# EAGLE design H-Bridge-Discrete (EAGLE 7.2.0)
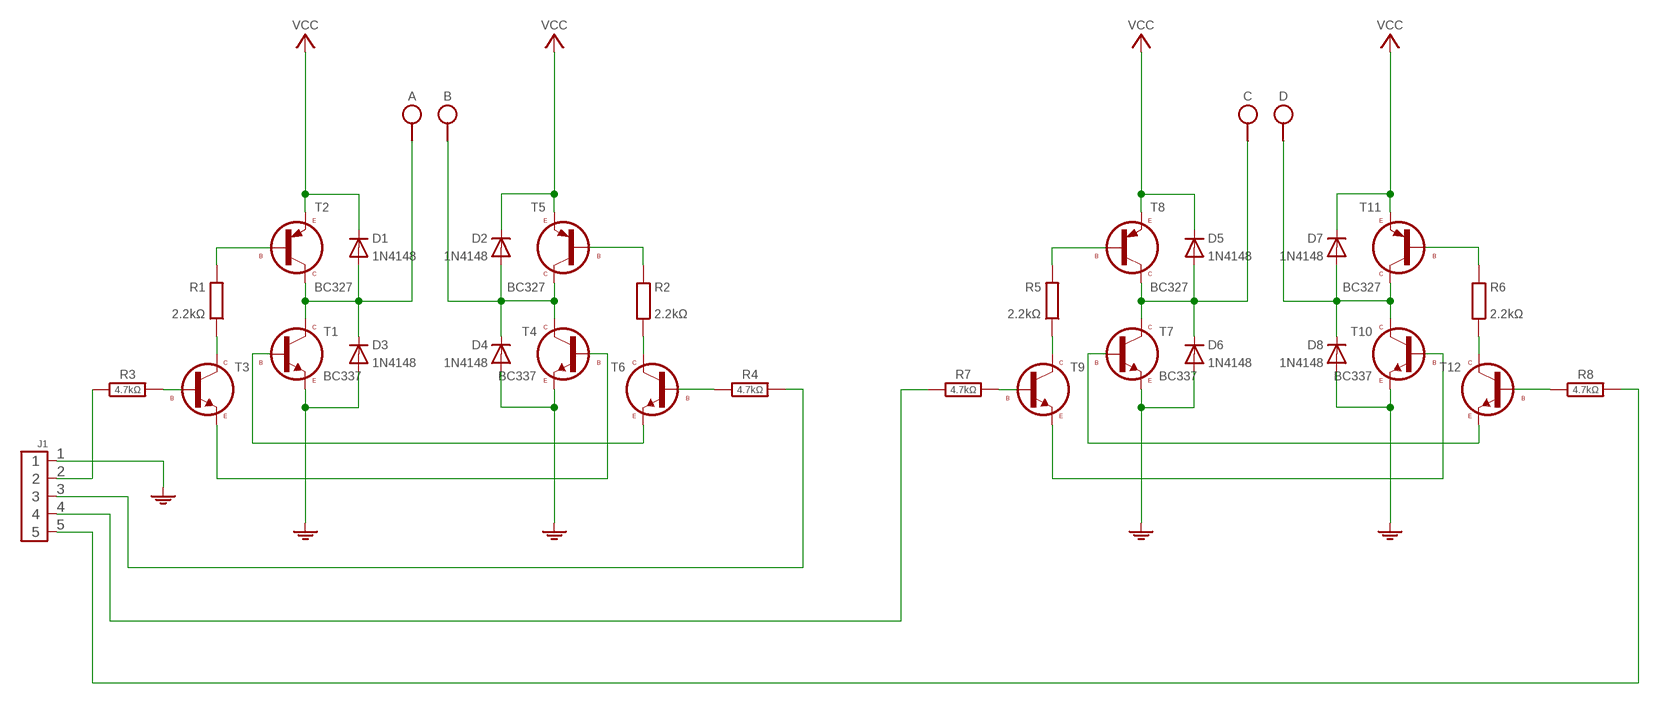
[diagram p0: schematic, sheet 1]

## Parts
A  VPORT  [SPAD]
B  VPORT  [SPAD]
C  VPORT  [SPAD]
D  VPORT  [SPAD]
D1  1N4148  DIODE-7-5  [DO7-5]
D2  1N4148  DIODE-7-5  [DO7-5]
D3  1N4148  DIODE-7-5  [DO7-5]
D4  1N4148  DIODE-7-5  [DO7-5]
D5  1N4148  DIODE-7-5  [DO7-5]
D6  1N4148  DIODE-7-5  [DO7-5]
D7  1N4148  DIODE-7-5  [DO7-5]
D8  1N4148  DIODE-7-5  [DO7-5]
J1  CONN-5P-5P  [CONN-5P]
R1  2.2kΩ  R0204/10  [0204/10]
R2  2.2kΩ  R0204/2  [0204/2]
R3  4.7kΩ  R-H0204/10  [0204/10]
R4  4.7kΩ  R-H0204/10  [0204/10]
R5  2.2kΩ  R0204/10  [0204/10]
R6  2.2kΩ  R0204/10  [0204/10]
R7  4.7kΩ  R-H0204/10  [0204/10]
R8  4.7kΩ  R-H0204/10  [0204/10]
S1  VCC_GND-508-L  [PWR-508-L]
T1  BC337  BC337CBE  [TO92-CBE]
T2  BC327  [TO92]
T3  BC547  [TO92]
T4  BC337  BC337CBE  [TO92-CBE]
T5  BC327  [TO92]
T6  BC547  [TO92]
T7  BC337  BC337CBE  [TO92-CBE]
T8  BC327  [TO92]
T9  BC547  [TO92]
T10  BC337  BC337CBE  [TO92-CBE]
T11  BC327  [TO92]
T12  BC547  [TO92]

## Nets
GND: D3.A D4.A D6.A D8.A J1.1 S1.1 T1.3(E) T4.3(E) T7.3(E) T10.3(E)
N$1: R2.1 T5.2(B)
N$2: R2.2 T6.1(C)
N$3: T1.2(B) T6.3(E)
N$4: R1.1 T2.2(B)
N$5: R1.2 T3.1(C)
N$6: T3.3(E) T4.2(B)
N$7: B.1 D2.A D4.C T4.1(C) T5.1(C)
N$8: A.1 D1.A D3.C T1.1(C) T2.1(C)
N$9: R3.2 T3.2(B)
N$10: R4.1 T6.2(B)
N$11: J1.2 R3.1
N$12: J1.3 R4.2
N$13: R5.1 T8.2(B)
N$14: R5.2 T9.1(C)
N$15: T9.3(E) T10.2(B)
N$16: C.1 D5.A D6.C T7.1(C) T8.1(C)
N$17: R6.1 T11.2(B)
N$18: R6.2 T12.1(C)
N$19: T7.2(B) T12.3(E)
N$20: D7.A D8.C D.1 T10.1(C) T11.1(C)
N$21: R8.1 T12.2(B)
N$22: R7.2 T9.2(B)
N$23: J1.5 R8.2
N$24: J1.4 R7.1
VCC: D1.C D2.C D5.C D7.C S1.2 T2.3(E) T5.3(E) T8.3(E) T11.3(E)

## Library data of the parts
A B C D = pad:VPORT
D1-D8 = d:DIODE
J1 = pinconn:CONN-5P
R1 R2 R5 R6 = r:R: RESISTOR, European symbol
R3 R4 R7 R8 = r:R-H
S1 = pad:VCC_GND
T1 T4 T7 T10 = t:BC337
T2 T5 T8 T11 = t:BC327
T3 T6 T9 T12 = t:BC547

## Board
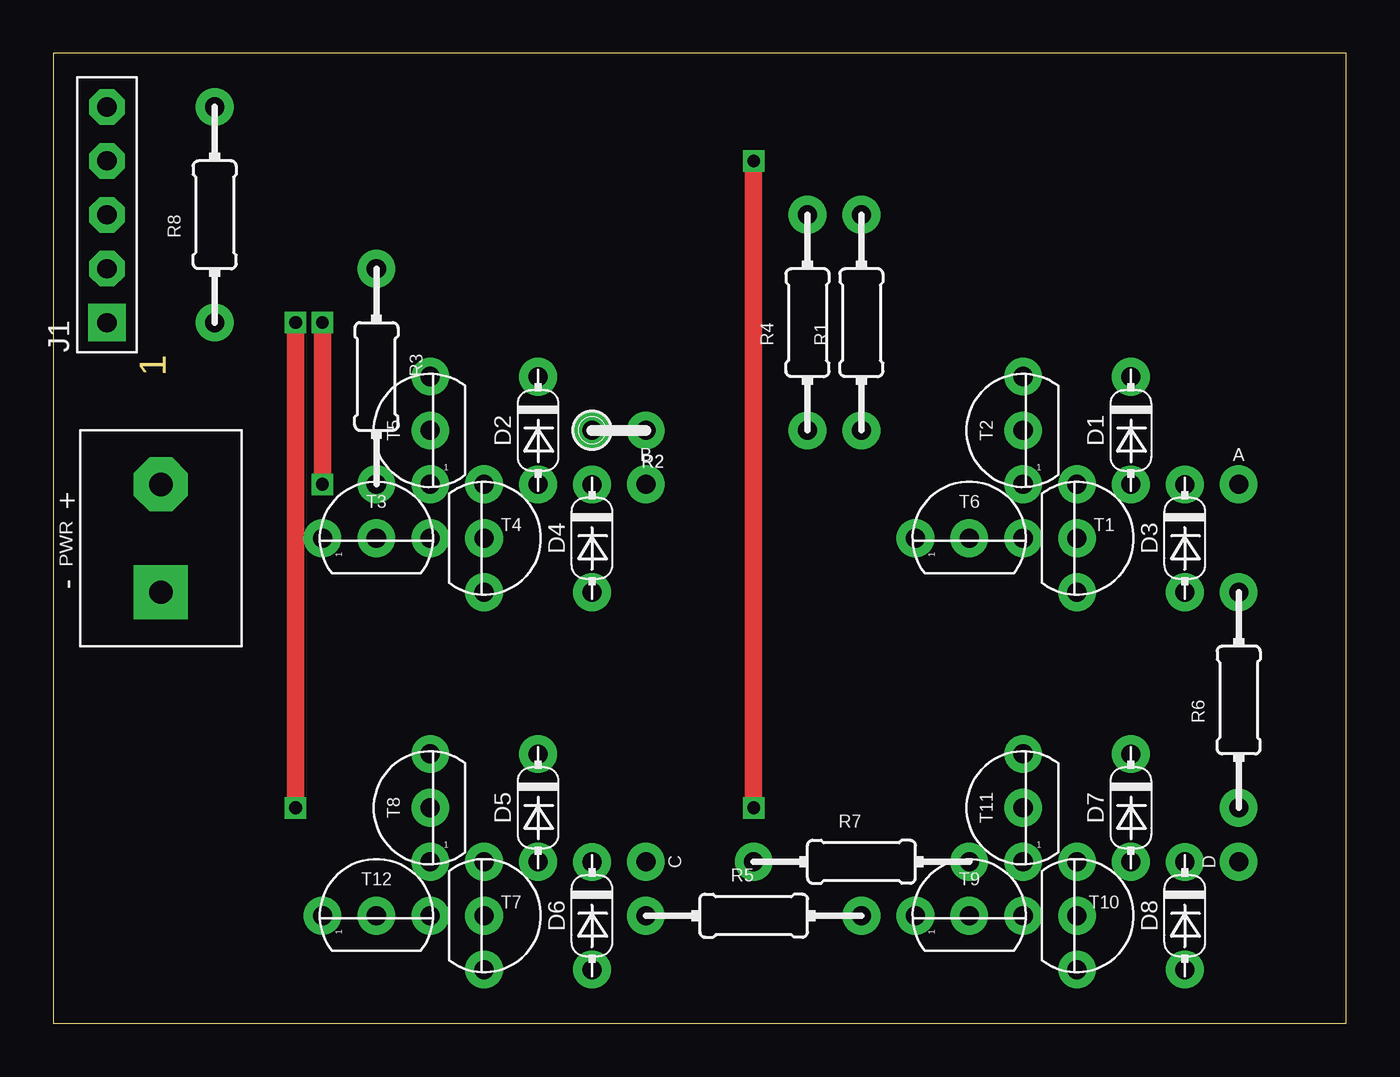
[diagram p1: board, top side]
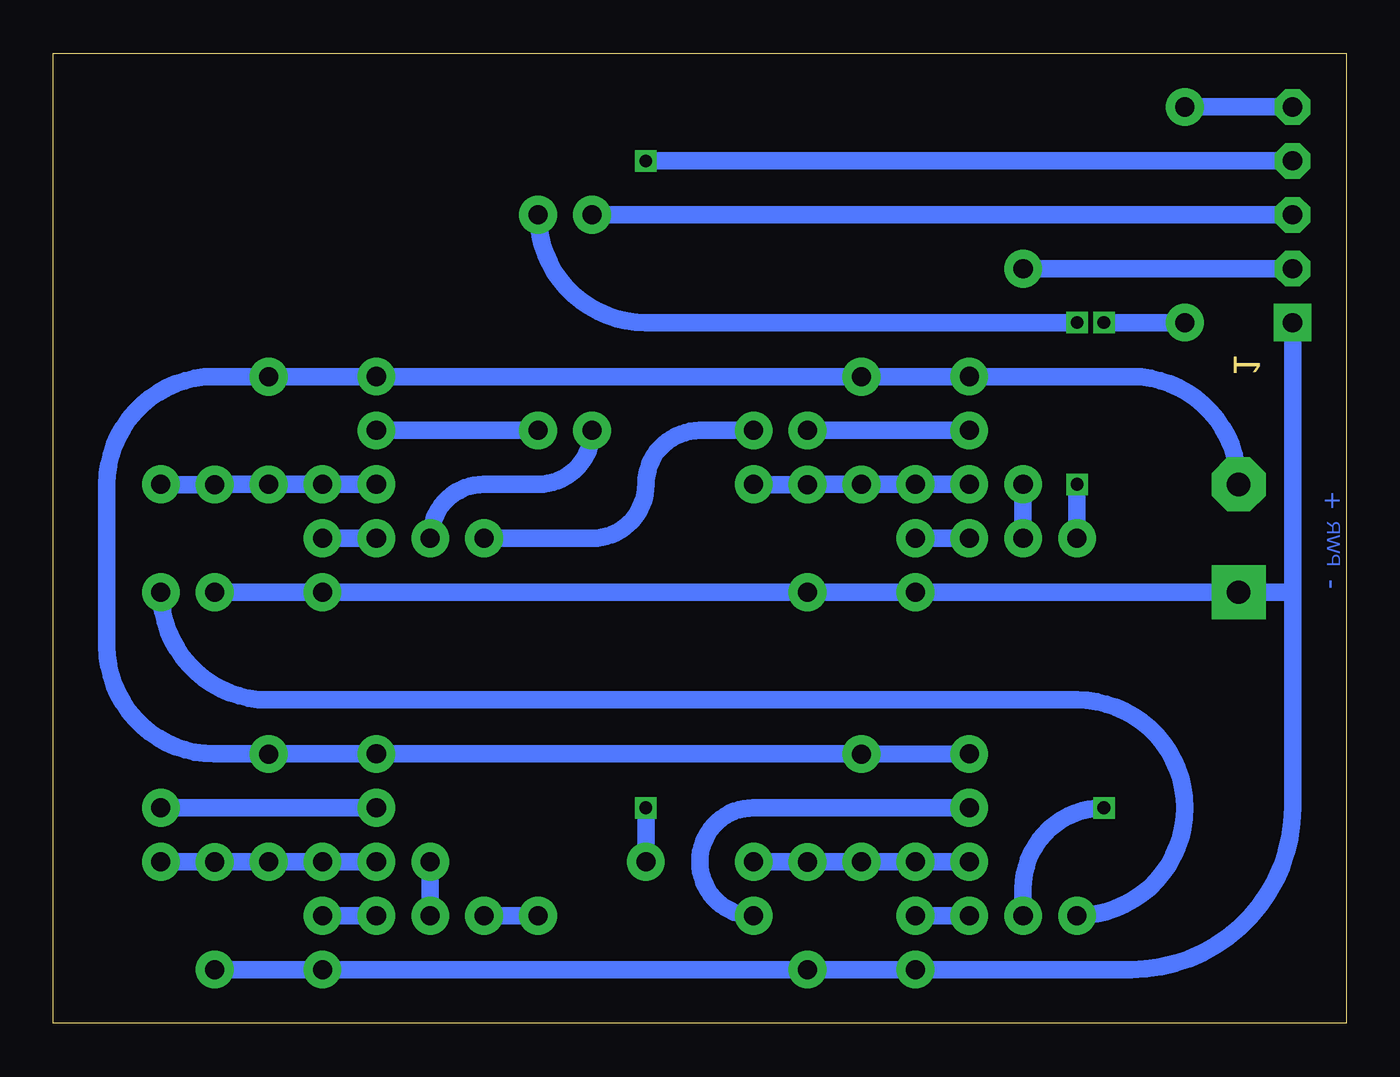
[diagram p2: board, bottom side, seen from below]

Size 60.96 x 45.72 mm. Coordinates in mm from the lower left corner, seen from the top.
Outline: 0,0 60.96,0 60.96,45.72 0,45.72 0,0
Copper layers (1*16): Top 0.035mm / dielectric 1.5mm / Bottom 0.035mm
Design rules "default": minimum track width 10mil, minimum drill 24mil, track to track 8mil, track to pad 8mil, pad to pad 8mil, via to via 8mil, smd to smd 8mil, copper to edge 40mil, drill to drill 8mil, minimum pad ring 10mil, minimum via ring 8mil, stop-mask expansion 4mil, vias tented up to drill 0mil, thermal gap 10mil

### Footprints (pad centres in the part's own frame; a part is rotated, then mirrored left to right if it is on the bottom)
SPAD = drill 0.9 pad 1.778: 1 0,0
DO7-5 = drill 0.9 pad 1.778: A 2.542,0.002; C -2.53,0.002
CONN-5P = drill 0.9 pad 1.778 square: 1 0,0 | drill 0.9 pad 1.676 octagon: 2 2.54,0; 3 5.08,0; 4 7.62,0; 5 10.16,0
0204/10 = drill 0.9 pad 1.778: 1 -5.08,0; 2 5.08,0
0204/2 = drill 0.9 pad 1.778: 1 1.27,0; 2 -1.27,0
PWR-508-L = drill 1.1 pad 2.54 square: 1 0,-2.54 | drill 1.1 pad 2.54 octagon: 2 0,2.54
TO92-CBE = drill 0.9 pad 1.778: 1 0,2.54; 2 0,0; 3 0,-2.54
TO92 = drill 0.9 pad 1.778: 1 0,2.54; 2 0,0; 3 0,-2.54

### Placement (x,y rotation side)
A  55.88,25.4 270 top
B  27.94,25.4 270 top
C  27.94,7.62 180 top
D  55.88,7.62 0 top
D1  50.8,27.94 270 top
D2  22.86,27.94 270 top
D3  53.34,22.86 270 top
D4  25.4,22.86 270 top
D5  22.86,10.16 270 top
D6  25.4,5.08 270 top
D7  50.8,10.16 270 top
D8  53.34,5.08 270 top
J1  2.54,33.02 90 top
R1  38.1,33.02 90 top
R2  26.67,27.94 180 top
R3  15.24,30.48 270 top
R4  35.56,33.02 90 top
R5  33.02,5.08 0 top
R6  55.88,15.24 90 top
R7  38.1,7.62 0 top
R8  7.62,38.1 90 top
S1  5.08,22.86 0 top
T1  48.26,22.86 0 top
T2  45.72,27.94 180 top
T3  15.24,22.86 90 top
T4  20.32,22.86 0 top
T5  17.78,27.94 180 top
T6  43.18,22.86 90 top
T7  20.32,5.08 0 top
T8  17.78,10.16 180 top
T9  43.18,5.08 90 top
T10  48.26,5.08 0 top
T11  45.72,10.16 180 top
T12  15.24,5.08 90 top

### Tracks (layer width: path | path; a pad name or v marks a point on that pad's centre or on a via)
GND
  Bottom 0.813: D4.A T4.3 S1.1 2.54,20.32 | D4.A 52.07,20.32 T1.3 D3.A | 2.54,20.32 J1.1 | D4.A 2.54,20.32 | 2.54,20.32 2.54,10.16 arc90 10.16,2.54 T7.3 D6.A | D6.A T10.3 D8.A | 2.54,20.32 | D6.A
N$1
  Bottom 0.813: T5.2 R2.1
N$2
  Bottom 0.813: T6.1 35.56,22.86 arc-90 33.02,25.4 arc90 30.48,27.94 R2.2
N$3
  Bottom 0.813: T6.3 T1.2
N$4
  Bottom 0.813: R1.1 T2.2
N$5  (via drill 0.6)
  Top 0.813: v12.7,33.02 v12.7,25.4
  Bottom 0.813: v12.7,25.4 T3.1 | R1.2 arc-90 33.02,33.02 v12.7,33.02
N$6
  Bottom 0.813: T3.3 T4.2
N$7
  Bottom 0.813: D2.A 21.59,25.4 T4.1 T5.1 D4.C B.1
N$8
  Bottom 0.813: D1.A T1.1 T2.1 D3.C A.1
N$9
  Bottom 0.813: T3.2 R3.2
N$10
  Bottom 0.813: R4.1 arc90 38.1,25.4 40.64,25.4 arc-90 T6.2
N$11
  Bottom 0.813: J1.2 R3.1
N$12
  Bottom 0.813: R4.2 J1.3
N$13
  Bottom 0.813: R5.1 arc90 30.48,7.62 arc90 27.94,10.16 T8.2
N$14
  Bottom 0.813: R5.2 T9.1
N$15
  Bottom 0.813: T9.3 T10.2
N$16
  Bottom 0.813: T8.1 D6.C 26.67,7.61 C.1 | T8.1 T7.1 | D5.A 19.05,7.62 T8.1
N$17
  Bottom 0.813: R6.1 T11.2
N$18
  Bottom 0.813: T12.1 arc-90 7.62,10.16 arc-90 12.7,15.24 50.8,15.24 arc90 R6.2
N$19
  Bottom 0.813: T7.2 T12.3
N$20
  Bottom 0.813: D.1 D8.C D7.A T11.1 T10.1 T11.1 D7.A
N$21  (via drill 0.6)
  Top 0.813: v11.43,33.02 v11.43,10.16
  Bottom 0.813: R8.1 v11.43,33.02 | v11.43,10.16 arc-90 15.24,6.35 T12.2
N$22
  Bottom 0.813: R7.2 T9.2
N$23
  Bottom 0.813: J1.5 R8.2
N$24  (via drill 0.6)
  Top 0.813: v33.02,10.16 v33.02,40.64
  Bottom 0.813: R7.1 v33.02,10.16 | v33.02,40.64 J1.4
VCC
  Bottom 0.813: T5.3 D2.C T5.3 | T5.3 | T5.3 T2.3 | T2.3 D1.C T2.3 | S1.2 arc-90 10.16,30.48 T5.3 | D5.C | T11.3 53.34,12.7 arc90 58.42,17.78 58.42,25.4 arc90 53.34,30.48 T2.3 | T11.3 D7.C | T8.3 D5.C | D5.C T11.3